# EAGLE design memory (EAGLE 5.06)
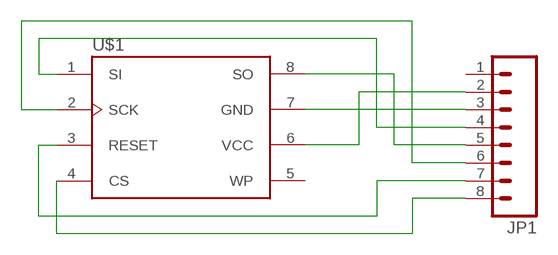
[diagram p0: schematic, sheet 1]

## Parts
JP1  M08LOCK  [1X08_LOCK]
U$1  ATMEL_DATA_FLASH  [SO08WIDE]

## Nets
N$1: JP1.2 U$1.6(VCC)
N$2: JP1.3 U$1.7(GND)
N$3: JP1.4 U$1.1(SI)
N$4: JP1.5 U$1.8(SO)
N$5: JP1.6 U$1.2(SCK)
N$6: JP1.8 U$1.4(CS)
N$7: JP1.7 U$1.3(RESET)
Unconnected: JP1.1 U$1.5(WP)

## Library data of the parts
JP1 = SparkFun:M08: Header 8 Standard 8-pin 0.1" header. Use with straight break away headers (SKU : PRT-00116), right angle break away headers (PRT-00553), swiss pins (PRT-00743), machine pins (PRT-00117), and female headers (PRT-00115).
U$1 = SparkFun:ATMEL_DATA_FLASH: 16Mbit EEPROM DataFlash Footprint needs touching up. Spark Fun Electronics SKU : COM-00301

## Board
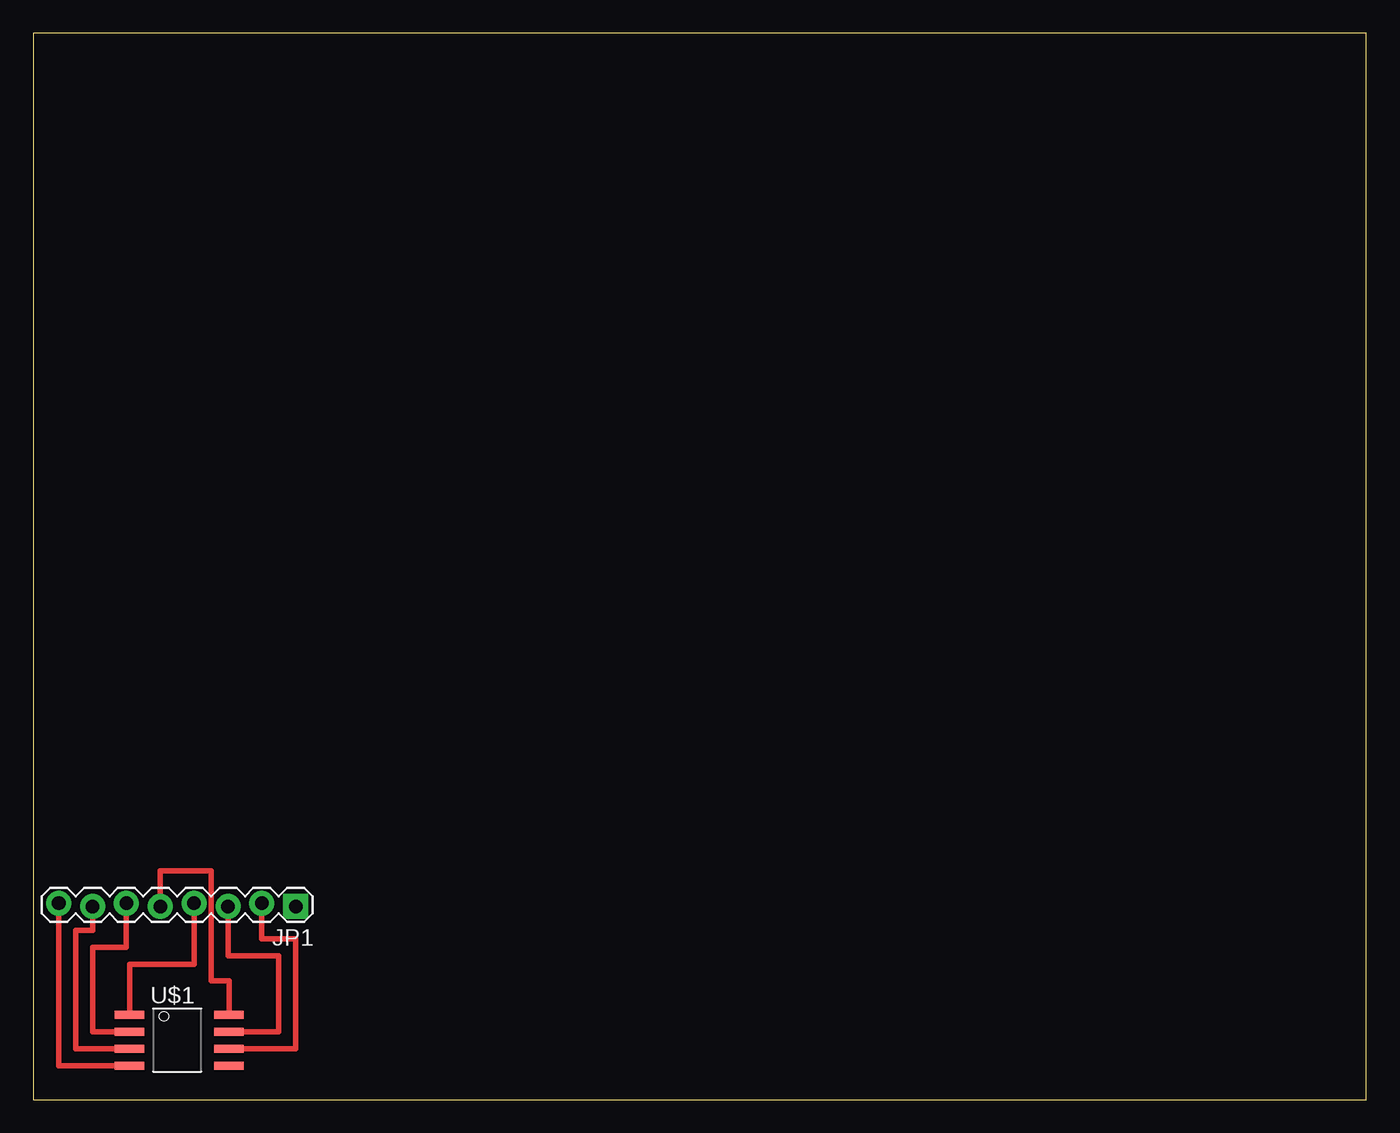
[diagram p1: board, top side]

Size 100 x 80 mm. Coordinates in mm from the lower left corner, seen from the top.
Outline: 0,0 100,0 100,80 0,80 0,0
Copper layers 1: Top 0.035mm
Design rules "default *": minimum track width 5mil, minimum drill 10mil, track to track 2mil, track to pad 2mil, pad to pad 2mil, via to via 2mil, smd to smd 2mil, copper to edge 10mil, drill to drill 8mil, minimum pad ring 10mil, minimum via ring 8mil, stop-mask expansion 4mil, vias tented up to drill 0mil, thermal gap 10mil

### Footprints (pad centres in the part's own frame; a part is rotated, then mirrored left to right if it is on the bottom)
1X08_LOCK = drill 1.016 pad 1.88 square: 1 0,0.127 | drill 1.016 pad 1.88 round: 2 2.54,-0.127; 3 5.08,0.127; 4 7.62,-0.127; 5 10.16,0.127; 6 12.7,-0.127; 7 15.24,0.127; 8 17.78,-0.127
SO08WIDE = smd 0.61 x 2.21: 1 -1.905,-3.569; 2 -0.635,-3.569; 3 0.635,-3.569; 4 1.905,-3.569; 5 1.905,3.886; 6 0.635,3.886; 7 -0.635,3.886; 8 -1.905,3.886

### Placement (x,y rotation side)
JP1  19.68,14.61 180 top
U$1  10.79,4.45 270 top

### Tracks (layer width: path | path; a pad name or v marks a point on that pad's centre or on a via)
N$1
  Top 0.406: U$1.6 19.68,3.81 19.68,12.06 17.14,12.06 JP1.2
N$2
  Top 0.406: U$1.7 18.41,5.08 18.41,10.79 14.61,10.79 JP1.3
N$3
  Top 0.406: U$1.1 7.23,10.16 12.06,10.16 JP1.4
N$4
  Top 0.406: U$1.8 14.68,8.89 13.34,8.89 13.34,17.14 9.53,17.14 JP1.5
N$5
  Top 0.406: U$1.2 4.45,5.08 4.45,11.43 6.99,11.43 JP1.6
N$6
  Top 0.406: U$1.4 1.91,2.54 JP1.8
N$7
  Top 0.406: U$1.3 3.17,3.81 3.17,12.7 4.45,12.7 JP1.7